# Altium schematic sheet Programmer.SchDoc
size A; SheetNumber: 3; SheetTotal: 4
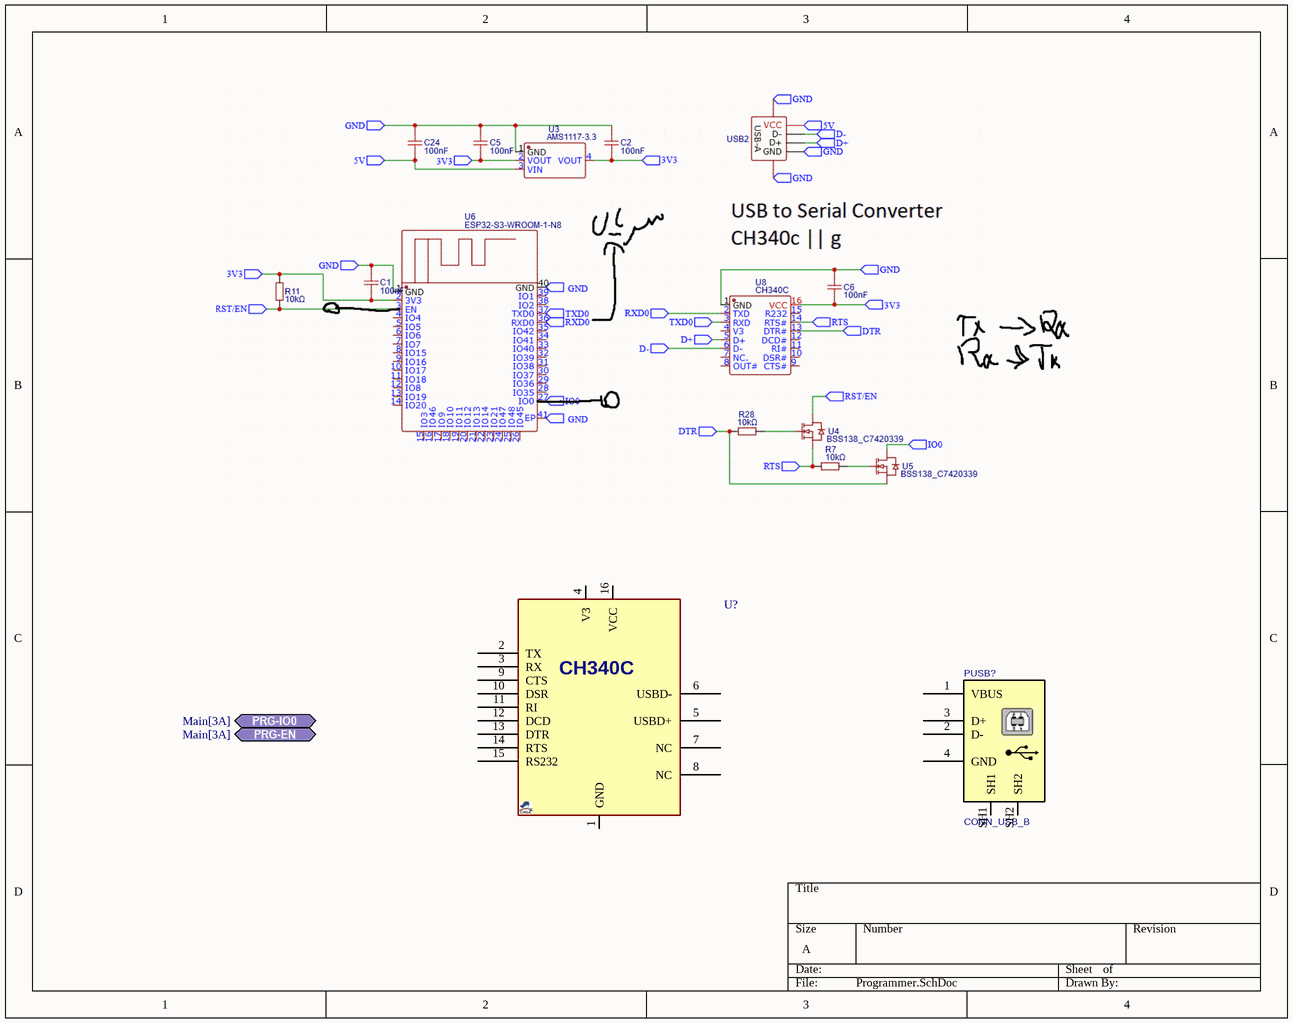
[diagram p0: Programmer.SchDoc]

## Parts
PUSB?  CONN_USB_B  [USB_B_RA_THD]
U?  CH340C  [SO_16]  (value not drawn)

## Ports
PRG-EN (bidir, see Main[3A]), PRG-IO0 (bidir, see Main[3A])

## Nets

Not connected (* = marked no-connect by the designer): PUSB? 1(VBUS) 2(D-) 3(D+) 4(GND) SH1 SH2; U? 1(GND) 2(TX) 3(RX) 4(V3) 5(USBD+) 6(USBD-) 7(NC) 8(NC) 9(CTS) 10(DSR) 11(RI) 12(DCD) 13(DTR) 14(RTS) 15(RS232) 16(VCC)

## Library data of the parts
PUSB? = CONN_USB_B_RA_THD: CONN, USB, B, R/A, THD; MANF_P#: 292304-1; MANF: TE Connectivity; VALUE: CONN_USB_B
U? = CH340C_SOP16: USB-UART; MANF_P#: CH340C; VALUE: CH340C; PACKAGE: SOP-16